# Altium schematic sheet XKT3619_wireless_charging_driver_T.SchDoc
size A4
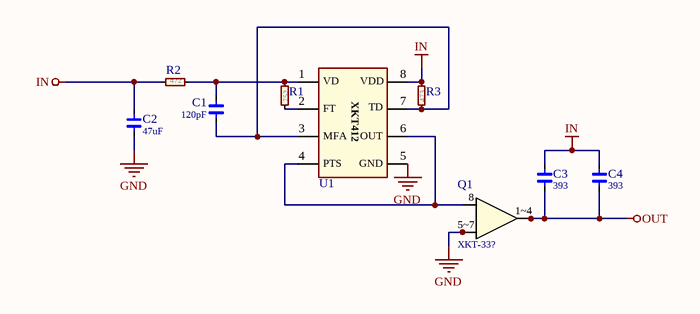
[diagram p0: XKT3619_wireless_charging_driver_T.SchDoc]

## Parts
C1  value 120pF  [CAP_0603]  (hidden comment: Cap)
C2  value 47uF  [CAP_1206]  (hidden comment: Cap)
C3  value 393  [CAP_1206]  (hidden comment: Cap)
C4  value 393  [CAP_1206]  (hidden comment: Cap)
Q1  XKT-33?  [SOP8_L]
R1  value 752  [RES_0603]  (hidden comment: Res)
R2  value 472  [RES_0603]  (hidden comment: Res)
R3  value 473  [RES_0603]  (hidden comment: Res)
U1  XKT-412  [SOP8_M]  (value not drawn)

## Nets
GND: C2.2 Q1.5(GND) Q1.6(GND) Q1.7(GND) U1.5(GND)
IN: C2.1 C3.1 C4.1 R2.1 R3.1 U1.8(VDD)
OUT: C3.2 C4.2 Q1.1(OUT) Q1.2(OUT) Q1.3(OUT) Q1.4(OUT)
NetC1_1: C1.1 R1.1 R2.2 U1.1(VD)
NetC1_2: C1.2 R3.2 U1.3(MFA) U1.7(TD)
NetQ1_8: Q1.8(IN) U1.4(PTS) U1.6(OUT)
NetR1_2: R1.2 U1.2(FT)

## Notes on the sheet
- (in symbol XKT-333/335) 1~4; 5~7
- (in symbol XKT-412) XKT412

## Library data of the parts
Q1 = XKT-333/335: XKT-333 335 是芯科泰最新开发的廉价优质 高频大功率输出集成电路，配合 XKT-412 芯 片工作体积小输出功率 强大，可工作较高的工作频率下在较高频率 范围内使用可大大减少发送线圈的体积和尺 寸增强发射功率，降低线圈成本，由于对线 圈电感量要求小也可直接采用 PCB 作为发射 使生产应用更加简便；芯片采用最先进的宽 电压自适应技术芯片设计工艺，同样的发射 电路可以在任意工作范围内电压使用而不改 变任何器件使用极为方便，电路极为简单， 具有精度高稳定性好等特点，其专门用于无 线感应智能充电、供电管理系统中，可靠性 能高。XKT-412 负责处理该系统中的无线电 能传输功能，采用电磁能量转换原理并配合 接收部分做能量转换及电路的实时监控；负 责各项电池的快速充电智能控制，XKT-412 只需配合极少的外部元件就可以做成高可靠 的无线快速充电器、无线电源供电。; Name: XKT-33?
U1 = XKT-412: XKT-412 是芯科泰最新开发的高频大功率 集成电路，体积小输出功率强大，可工作 在较高频率范围内使用可大大减少发送线 圈的体积和尺寸增强发射功率，降低线圈 成本，由于对线圈电感量要求小也可直接 采用 PCB 作为发射使生产应用更加简便； 芯片采用最先进的宽电压自适应技术芯片 设计工艺，同样的发射电路可以在任意工 作范围内电压使用而不改变任何器件使用 极为方便，电路极为简单，具有精度高稳 定性好等特点，其专门用于无线感应智能 充电、供电管理系统中，可靠性能高。XK T-412 负责处理该系统中的无线电能传输功 能，采用电磁能量转换原理并配合接收部分 做能量转换及电路的实时监控；负责各项电 池的快速充电智能控制，XKT-412 只需配合 极少的外部元件就可以做成高可靠的无线快 速充电器、无线电源供电。